# EAGLE design PHT_logger (EAGLE 9.6.2)
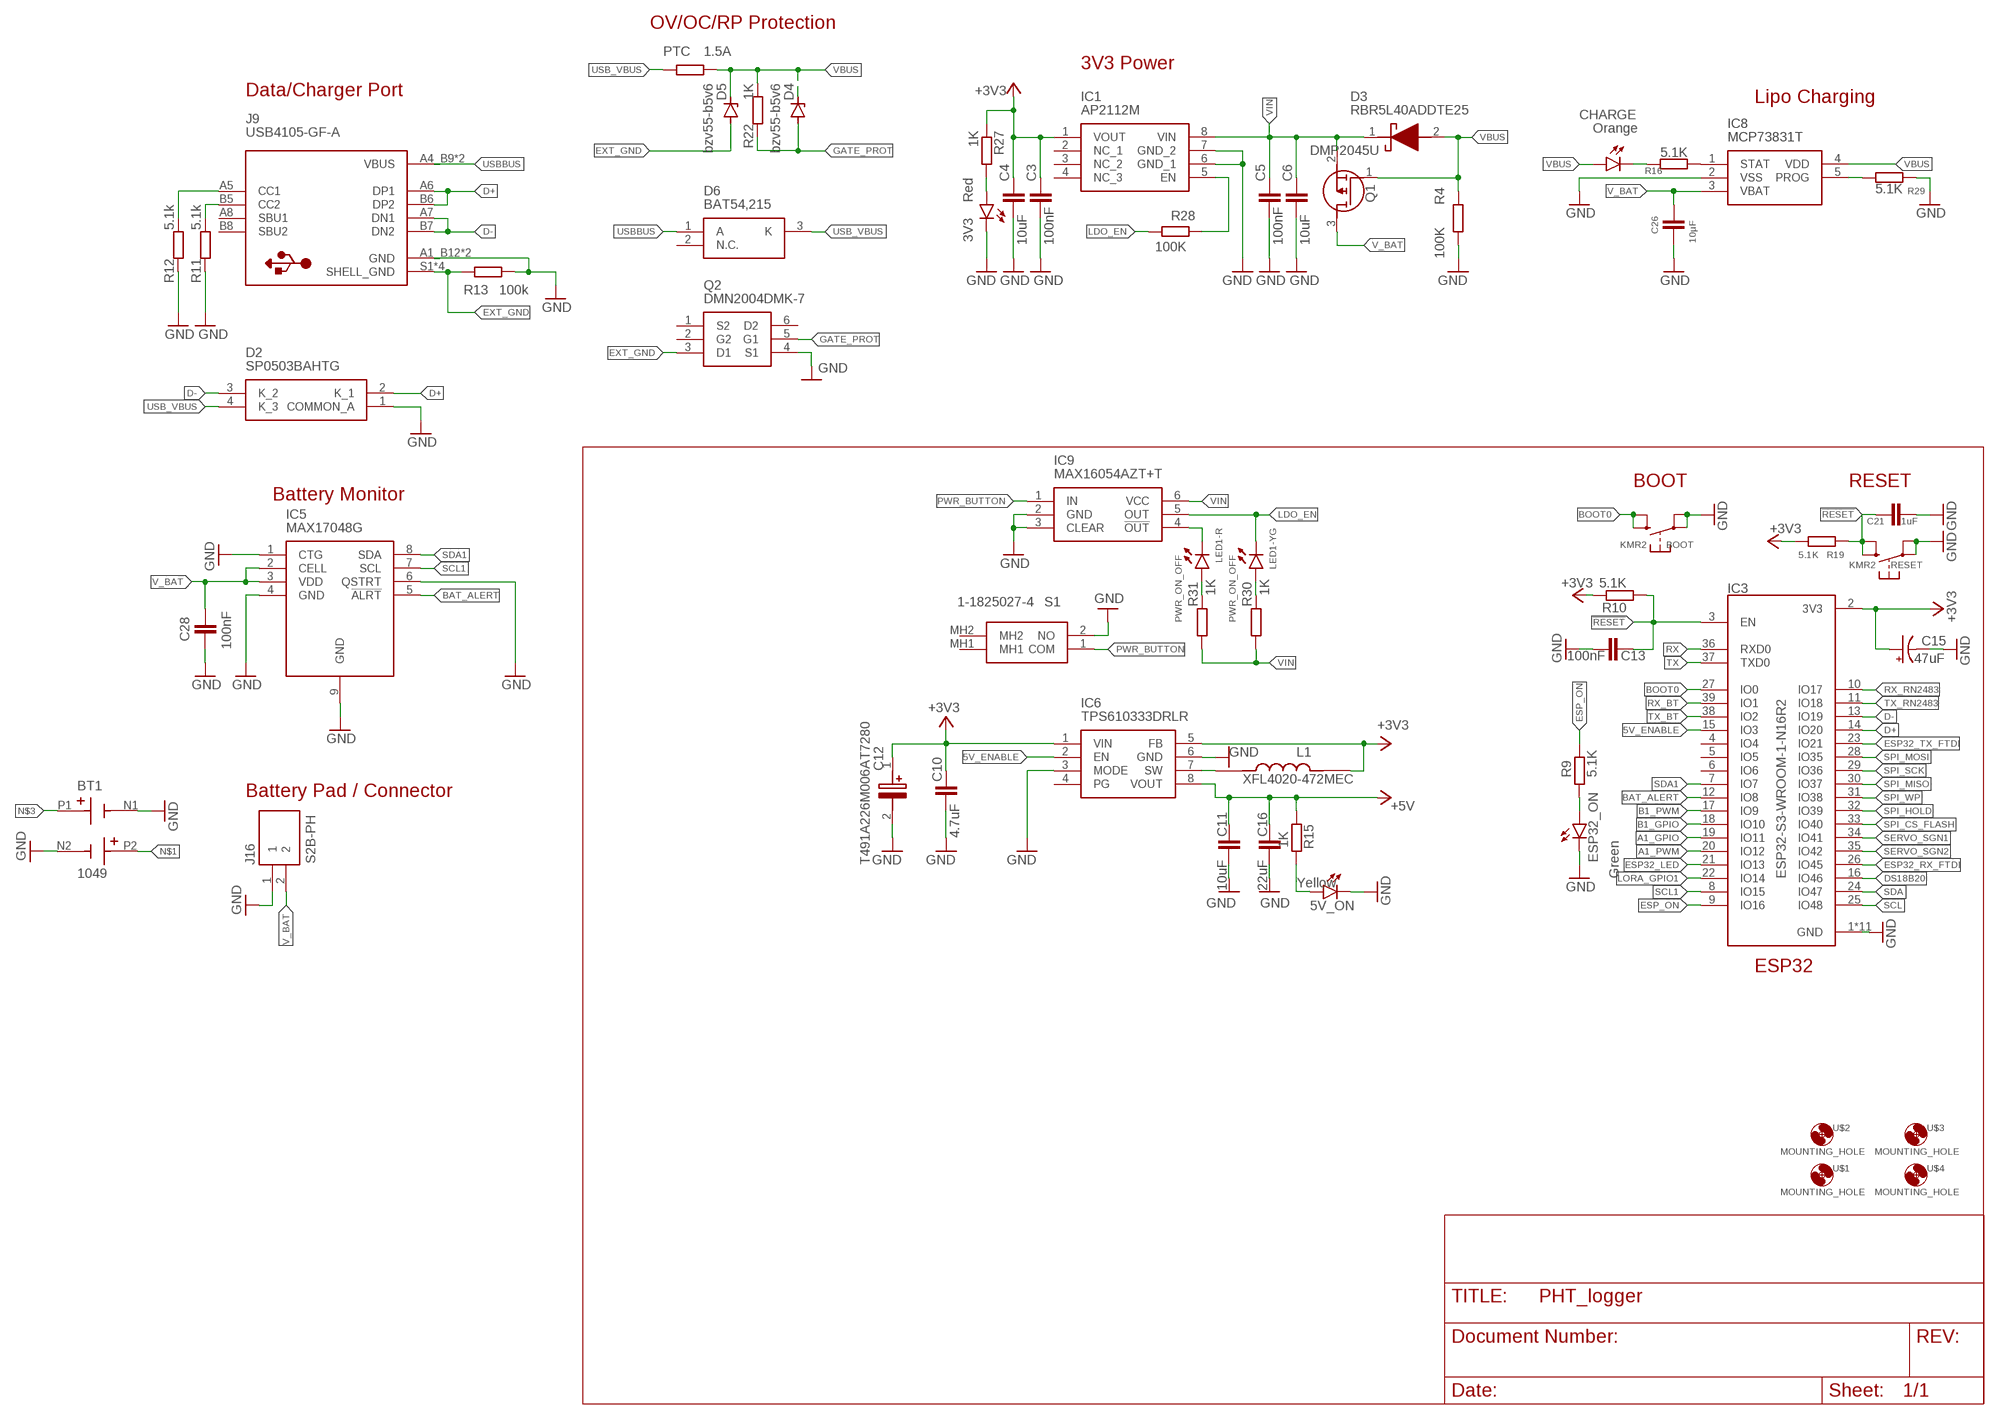
[diagram p0: schematic, sheet 1]

## Parts
3V3  Red  LEDCHIPLED_0805  [CHIPLED_0805]
5V_ON  Yellow  LEDCHIPLED_0805  [CHIPLED_0805]
BOOT  KMR2  SWITCH_TACT_SMT4.6X2.8  [BTN_KMR2_4.6X2.8]
BT1  1049  [BAT_1049]
C3  100nF  C-EUC0603  [C0603]
C4  10uF  C-EUC0603  [C0603]
C5  100nF  C-EUC0603  [C0603]
C6  10uF  C-EUC0603  [C0603]
C10  4.7uF  C-EUC0805  [C0805]
C11  10uF  C-EUC0805  [C0805]
C12  T491A226M006AT7280  [T491A]
C13  100nF  C-EUC0603  [C0603]
C15  47uF  293D226X9025C2TE3  [CAPMP6032X250N]
C16  22uF  C-EUC0805  [C0805]
C21  1uF  C-EUC0603  [C0603]
C26  10µF  C-EUC0603K  [C0603K]
C28  100nF  C-EUC0603  [C0603]
CHARGE  Orange  LEDCHIPLED_0805  [CHIPLED_0805]
D2  SP0503BAHTG  [SP0503BAHTG]
D3  RBR5L40ADDTE25  [DIOM5026X220N]
D4  bzv55-b5v6  ZENER-DIODESOD80C  [SOD80C]
D5  bzv55-b5v6  ZENER-DIODESOD80C  [SOD80C]
D6  BAT54,215  [SOT95P230X110-3N]
ESP32_ON  Green  LEDCHIPLED_0805  [CHIPLED_0805]
IC1  AP2112M  AP2112M-3.3TRG1  [SOIC127P600X170-8N]
IC3  ESP32-S3-WROOM-1-N16R2  [XCVR_ESP32-S3-WROOM-1-N16R2]
IC5  MAX17048G  MAX17048G+T10  [SON50P200X200X80-9N]
IC6  TPS610333DRLR  [SOTFL50P160X60-8N]
IC8  MCP73831T  MCP73831T-2ACI_OT  [SOT95P270X145-5N]
IC9  MAX16054AZT+T  [SOT95P275X110-6N]
J9  USB4105-GF-A  [GCT_USB4105-GF-A]
J16  S2B-PH  S2B-PH-K-S(LF)(SN)  [JST_S2B-PH-K-S(LF)(SN)]
L1  XFL4020-472MEC  [IND_XFL4020-472MEC]
LED1  PWR_ON_OFF  OSRG1206C1C  [3216(1206)-4]
PTC  1.5A  R-EU_R2512  [R2512]
Q1  DMP2045U  DMP2045U-7  [SOT96P240X110-3N]
Q2  DMN2004DMK-7  [SOT95P285X145-6N]
R4  100K  R-EU_R0603  [R0603]
R9  5.1K  R-EU_R0603  [R0603]
R10  5.1K  R-EU_R0603  [R0603]
R11  5.1k  R-EU_R0603  [R0603]
R12  5.1k  R-EU_R0603  [R0603]
R13  100k  R-EU_R0603  [R0603]
R15  1K  R-EU_R0603  [R0603]
R16  5.1K  R-EU_R0603  [R0603]
R19  5.1K  R-EU_R0603  [R0603]
R22  1K  R-EU_R0603  [R0603]
R27  1K  R-EU_R0603  [R0603]
R28  100K  R-EU_R0603  [R0603]
R29  5.1K  R-EU_R0603  [R0603]
R30  1K  R-EU_R0603  [R0603]
R31  1K  R-EU_R0603  [R0603]
RESET  KMR2  SWITCH_TACT_SMT4.6X2.8  [BTN_KMR2_4.6X2.8]
S1  1-1825027-4  [118250274]
U$1  MOUNTING_HOLE  [MOUNTING_HOLE]
U$2  MOUNTING_HOLE  [MOUNTING_HOLE]
U$3  MOUNTING_HOLE  [MOUNTING_HOLE]
U$4  MOUNTING_HOLE  [MOUNTING_HOLE]

## Nets
5V_ENABLE: IC3.15(IO3) IC6.2(EN)
!RESET: C13.1 C21.1 IC3.3(EN) R10.1 R19.1 RESET.B'(S1) RESET.B(S)
+3V3: C3.2 C4.2 C10.2 C12.1(+) C15.1(+) IC1.1(VOUT) IC3.2(3V3) IC6.1(VIN) IC6.5(FB) L1.2 R10.2 R19.2 R27.1
+5V: C11.2 C16.2 IC6.8(VOUT) R15.1
A1_GPIO: IC3.19(IO11)
A1_PWM: IC3.20(IO12)
B1_GPIO: IC3.18(IO10)
B1_PWM: IC3.17(IO9)
BAT_ALERT: IC3.12(IO8) IC5.5(!ALRT)
BOOT0: BOOT.B'(S1) BOOT.B(S) IC3.27(IO0)
D+: D2.2(K_1) IC3.14(IO20) J9.A6(DP1) J9.B6(DP2)
D-: D2.3(K_2) IC3.13(IO19) J9.A7(DN1) J9.B7(DN2)
DS18B20: IC3.16(IO46)
ESP32_LED: IC3.21(IO13)
ESP32_RX_FTDI: IC3.26(IO45)
ESP32_TX_FTDI: IC3.23(IO21)
ESP_ON: IC3.9(IO16) R9.2
EXT_GND: D5.A J9.S1(SHELL_GND) J9.S2(SHELL_GND) J9.S3(SHELL_GND) J9.S4(SHELL_GND) Q2.3(D1) R13.2
GATE_PROT: D4.A Q2.5(G1) R22.1
GND: 3V3.C 5V_ON.C BOOT.A'(P1) BOOT.A(P) BT1.N1(NEG1) BT1.N2(NEG2) C3.1 C4.1 C5.1 C6.1 C10.1 C11.1 C12.2(-) C13.2 C15.2(-) C16.1 C21.2 C26.2 C28.2 D2.1(COMMON_A) ESP32_ON.C IC1.6(GND_1) IC1.7(GND_2) IC3.1(GND) IC3.40(GND) IC3.41_1(GND) IC3.41_2(GND) IC3.41_3(GND) IC3.41_4(GND) IC3.41_5(GND) IC3.41_6(GND) IC3.41_7(GND) IC3.41_8(GND) IC3.41_9(GND) IC5.1(CTG) IC5.4(GND) IC5.6(QSTRT) IC5.9(GND) IC6.3(MODE) IC6.6(GND) IC8.2(VSS) IC9.2(GND) IC9.3(CLEAR) J9.A1_B12(GND) J9.B1_A12(GND) J16.1 Q2.4(S1) R4.2 R11.1 R12.1 R13.1 R29.1 RESET.A'(P1) RESET.A(P) S1.2(NO)
LDO_EN: IC9.5(OUT) LED1.3(-YG:C) R28.1
LORA_GPIO1: IC3.22(IO14)
N$1: BT1.P2(POS2)
N$3: BT1.P1(POS1)
N$6: ESP32_ON.A R9.1
N$9: IC6.7(SW) L1.1
N$10: 5V_ON.A R15.2
N$11: CHARGE.C R16.1
N$12: IC9.4(!OUT) LED1.1(-R:C)
N$13: IC1.5(EN) R28.2
N$14: LED1.4(-YG:A) R30.2
N$15: LED1.2(-R:A) R31.2
N$16: J9.B5(CC2) R11.2
N$17: IC8.1(STAT) R16.2
N$18: IC8.5(PROG) R29.2
N$21: J9.A5(CC1) R12.2
N$33: 3V3.A R27.2
PWR_BUTTON: IC9.1(IN) S1.1(COM)
RX: IC3.36(RXD0)
RX_BT: IC3.39(IO1)
RX_RN2483: IC3.10(IO17)
SCL: IC3.25(IO48)
SCL1: IC3.8(IO15) IC5.7(SCL)
SDA: IC3.24(IO47)
SDA1: IC3.7(IO7) IC5.8(SDA)
SERVO_SGN1: IC3.34(IO41)
SERVO_SGN2: IC3.35(IO42)
SPI_CS_FLASH: IC3.33(IO40)
SPI_HOLD: IC3.32(IO39)
SPI_MISO: IC3.30(IO37)
SPI_MOSI: IC3.28(IO35)
SPI_SCK: IC3.29(IO36)
SPI_WP: IC3.31(IO38)
TX: IC3.37(TXD0)
TX_BT: IC3.38(IO2)
TX_RN2483: IC3.11(IO18)
USB_VBUS: D2.4(K_3) D6.3(K) PTC.1
USBBUS: D6.1(A) J9.A4_B9(VBUS) J9.B4_A9(VBUS)
V_BAT: C26.1 C28.1 IC5.2(CELL) IC5.3(VDD) IC8.3(VBAT) J16.2 Q1.3(D)
VBUS: CHARGE.A D3.2(A) D4.C D5.C IC8.4(VDD) PTC.2 Q1.1(G) R4.1 R22.2
VIN: C5.2 C6.2 D3.1(K) IC1.8(VIN) IC9.6(VCC) Q1.2(S) R30.1 R31.1
Unconnected: D6.2(N.C.) IC1.2(NC_1) IC1.3(NC_2) IC1.4(NC_3) IC3.4(IO4) IC3.5(IO5) IC3.6(IO6) IC6.4(PG) J9.A8(SBU1) J9.B8(SBU2) Q2.1(S2) Q2.2(G2) Q2.6(D2) S1.MH1 S1.MH2

## Notes on the sheet
- OV/OC/RP Protection
- 3V3 Power
- Data/Charger Port
- Lipo Charging
- BOOT | RESET
- Battery Monitor
- Battery Pad / Connector
- ESP32

## Library data of the parts
3V3 5V_ON CHARGE ESP32_ON = led:LED: LED OSRAM: - CHIPLED LG R971, LG N971, LY N971, LG Q971, LY Q971, LO R971, LY R971 LH N974, LH R974 LS Q976, LO Q976, LY Q976 LO Q996 - Hyper CHIPLED LW Q18S LB Q993, LB Q99A, LB R99A - SideLED LS A670, LO A670, LY A670, LG A670, LP A670 LB A673, LV A673, LT A673, LW A673 LH A674 LY A675 LS A676, LA A676, LO A676, LY A676, LW A676 LS A679, LY A679, LG A679 - Hyper Micro SIDELED® LS Y876, LA Y876, LO Y876, LY Y876 LT Y87S - SmartLED LW L88C, LW L88S LB L89C, LB L89S, LG L890 LS L89K, LO L89K, LY L89K LS L896, LA L896, LO L896, LY L896 - TOPLED LS T670, LO T670, LY T670, LG T670, LP T670 LSG T670, LSP T670, LSY T670, LOP T670, LYG T670 LG T671, LOG T671, LSG T671 LB T673, LV T673, LT T673, LW T673 LH T674 LS T676, LA T676, LO T676, LY T676, LB T676, LH T676, LSB T676, LW T676 LB T67C, LV T67C, LT T67C, LS T67K, LO T67K, LY T67K, LW E67C LS E67B, LA E67B, LO E67B, LY E67B, LB E67C, LV E67C, LT E67C LW T67C LS T679, LY T679, LG T679 LS T770, LO T770, LY T770, LG T770, LP T770 LB T773, LV T773, LT T773, LW T773 LH T774 LS E675, LA E675, LY E675, LS T675 LS T776, LA T776, LO T776, LY T776, LB T776 LHGB T686 LT T68C, LB T68C - Hyper Mini TOPLED® LB M676 - Mini TOPLED Santana® LG M470 LS M47K, LO M47K, LY M47K Source: http://www.osram.convergy.de LUXEON: - LUMILED® LXK2-PW12-R00, LXK2-PW12-S00, LXK2-PW14-U00, LXK2-PW14-V00 LXK2-PM12-R00, LXK2-PM12-S00, LXK2-PM14-U00 LXK2-PE12-Q00, LXK2-PE12-R00, LXK2-PE12-S00, LXK2-PE14-T00, LXK2-PE14-U00 LXK2-PB12-K00, LXK2-PB12-L00, LXK2-PB12-M00, LXK2-PB14-N00, LXK2-PB14-P00, LXK2-PB14-Q00 LXK2-PR12-L00, LXK2-PR12-M00, LXK2-PR14-Q00, LXK2-PR14-R00 LXK2-PD12-Q00, LXK2-PD12-R00, LXK2-PD12-S00 LXK2-PH12-R00, LXK2-PH12-S00 LXK2-PL12-P00, LXK2-PL12-Q00, LXK2-PL12-R00 Source: www.luxeon.com KINGBRIGHT: KA-3528ASYC Source: www.kingbright.com
BOOT RESET = microbuilder:SWITCH_TACT_SMT: SMT Tact Switches 6x6mm - Digikey: P12940SCT-ND KMR2 (4.6x2.8mm) - Digikey: 401-1426-1-ND EVQ-PQHB55 - Light Touch, 160GF (4.5x4.5mm) - Digikey: P8090SCT-ND KMT0 - KMT021 NGJ LHS (etc.) IP68/Waterproof - Digikey: CKN10289CT-ND
BT1 = 1049:1049: Check availability <https://pricing.snapeda.com/parts/1049/Keystone%20Electronics/view-part?ref=eda>; AVAILABILITY: In Stock; CHECK_PRICES: https://www.snapeda.com/parts/1049/Keystone/view-part/?ref=eda; DESCRIPTION: THM Holder for Dual 18650 Batteries; MF: Keystone Electronics; MP: 1049; PACKAGE: None; PRICE: None; PURCHASE-URL: https://www.snapeda.com/api/url_track_click_mouser/?unipart_id=5529224&manufacturer=Keystone Electronics&part_name=1049&search_term=None; SNAPEDA_LINK: https://www.snapeda.com/parts/1049/Keystone/view-part/?ref=snap
C3-C6 C10 C11 C13 C16 C21 C26 C28 = rcl:C-EU: CAPACITOR, European symbol; SPICEPREFIX: C
C12 = T491A226M006AT7280:T491A226M006AT7280: T491, Tantalum, MnO2 Tantalum, Commercial Grade, 22 uF, 20%, 6.3 VDC, 125C, -55C, 85C, SMD, MnO2, Molded, 6 % , 3 Ohms, 1400 nA, 58.6 mg, 3216, 1.6mm, Height Max = 1.8mm, 9000, 156 Weeks Source: Datasheet <https://content.kemet.com/datasheets/KEM_T2005_T491.pdf>; DESCRIPTION: T491, Tantalum, MnO2 Tantalum, Commercial Grade, 22 uF, 20%, 6.3 VDC, 125C, -55C, 85C, SMD, MnO2, Molded, 6 % , 3 Ohms, 1400 nA, 58.6 mg, 3216, 1.6mm, Height Max = 1.8mm, 9000, 156 Weeks; HEIGHT: 1.8mm; MANUFACTURER_NAME: KEMET; MANUFACTURER_PART_NUMBER: T491A226M006AT7280
C15 = 293D226X9025C2TE3:293D226X9025C2TE3: Surface Mount Tantalum Capacitor, TANTAMOUNTr, 293D Series, 22 F, 10%, 25 V, 2412 Check prices <https://pricing.snapeda.com/parts/293D226X9025C2TE3/Vishay/view-part?ref=eda>; AVAILABILITY: Warning; DESCRIPTION: Surface Mount Tantalum Capacitor, TANTAMOUNTr, 293D Series, 22 F, 10%, 25 V, 2412 [6032 Metric]; MF: Vishay; MP: 293D226X9025C2TE3; PACKAGE: None; PRICE: None; PURCHASE-URL: https://pricing.snapeda.com/search/part/293D226X9025C2TE3/?ref=eda
D2 = SP0503BAHTG:SP0503BAHTG: ESD Suppressors / TVS Diodes TVS AVAL DIODE SMT Source: Datasheet; DESCRIPTION: ESD Suppressors / TVS Diodes TVS AVAL DIODE SMT; HEIGHT: 1.22mm; MANUFACTURER_NAME: LITTELFUSE; MANUFACTURER_PART_NUMBER: SP0503BAHTG; MOUSER_PART_NUMBER: 576-SP0503BAHTG; MOUSER_PRICE-STOCK: https://www.mouser.co.uk/ProductDetail/Littelfuse/SP0503BAHTG?qs=uD%2FdkN7XIa0NTYXwHdELYA%3D%3D
D3 = RBR5L40ADDTE25:RBR5L40ADDTE25: Low VF, 40V, 5A, DO-214AC (SMA), Schottky Barrier Diode for Automotive Source: Datasheet <https://fscdn.rohm.com/en/products/databook/datasheet/discrete/diode/schottky_barrier/rbr5l40addte25-e.pdf>; DESCRIPTION: Low V<sub>F</sub>, 40V, 5A, DO-214AC (SMA), Schottky Barrier Diode for Automotive; HEIGHT: 2.2mm; MANUFACTURER_NAME: ROHM Semiconductor; MANUFACTURER_PART_NUMBER: RBR5L40ADDTE25; MOUSER_PART_NUMBER: 755-RBR5L40ADDTE25; MOUSER_PRICE-STOCK: https://www.mouser.co.uk/ProductDetail/ROHM-Semiconductor/RBR5L40ADDTE25?qs=4v%252BiZTmLVHF3vONcYZtHDg%3D%3D
D4 D5 = diode:ZENER-DIODE: Z-Diode
D6 = BAT54_215:BAT54,215: Schottky barrier diode,BAT54 0.2A 30V NXP BAT54,215, SMT Schottky Diode, 30V 200mA, 5ns, 3-Pin TO-236AB Source: Datasheet <https://assets.nexperia.com/documents/data-sheet/BAT54.pdf>; DESCRIPTION: Schottky barrier diode,BAT54 0.2A 30V NXP BAT54,215, SMT Schottky Diode, 30V 200mA, 5ns, 3-Pin TO-236AB; HEIGHT: 1.1mm; MANUFACTURER_NAME: Nexperia; MANUFACTURER_PART_NUMBER: BAT54,215; MOUSER_PART_NUMBER: 771-BAT54-T/R; MOUSER_PRICE-STOCK: https://www.mouser.co.uk/ProductDetail/Nexperia/BAT54215?qs=me8TqzrmIYXKuR53XX9Zmg%3D%3D
IC1 = AP2112M-3.3TRG1:AP2112M-3.3TRG1: LDO Voltage Regulators LDO CMOS HiCurr Source: Datasheet <https://www.diodes.com/assets/Datasheets/AP2112.pdf>; DESCRIPTION: LDO Voltage Regulators LDO CMOS HiCurr; HEIGHT: 1.7mm; MANUFACTURER_NAME: Diodes Inc.; MANUFACTURER_PART_NUMBER: AP2112M-3.3TRG1; MOUSER_PART_NUMBER: 621-AP2112M-3.3TRG1; MOUSER_PRICE-STOCK: https://www.mouser.co.uk/ProductDetail/Diodes-Incorporated/AP2112M-3.3TRG1?qs=5V6w%252Be2aIqa1YM8VADFBsQ%3D%3D
IC3 = ESP32-S3-WROOM-1-N16R2_v2a:ESP32-S3-WROOM-1-N16R2: Check availability <https://pricing.snapeda.com/parts/ESP32-S3-WROOM-1-N16R2/Espressif%20Systems/view-part?ref=eda>; AVAILABILITY: In Stock; DESCRIPTION: Bluetooth, WiFi 802.11b/g/n, Bluetooth v5.0 Transceiver Module 2.4GHz PCB Trace Surface Mount; MF: Espressif Systems; MP: ESP32-S3-WROOM-1-N16R2; PACKAGE: None; PRICE: None; PURCHASE-URL: https://pricing.snapeda.com/search?q=ESP32-S3-WROOM-1-N16R2&ref=eda; SPICEPREFIX: X
IC5 = MAX17048G+T10:MAX17048G+T10: Battery Management Host-Side Modelgauge (1-Cell) Source: Datasheet <https://datasheets.maximintegrated.com/en/ds/MAX17048-MAX17049.pdf>; DESCRIPTION: Battery Management Host-Side Modelgauge (1-Cell); HEIGHT: 0.8mm; MANUFACTURER_NAME: Maxim Integrated; MANUFACTURER_PART_NUMBER: MAX17048G+T10; MOUSER_PART_NUMBER: 700-MAX17048G+T10; MOUSER_PRICE-STOCK: https://www.mouser.co.uk/ProductDetail/Maxim-Integrated/MAX17048G%2bT10?qs=D7PJwyCwLAoGnnn8jEPRBQ%3D%3D
IC6 = TPS610333DRLR:TPS610333DRLR: Switching Voltage Regulators 5-V, 1.85-A boost converter with power good, output discharge and PFM/PWM control 8-SOT-5X3 -40 to 125 Source: Datasheet <https://www.ti.com/lit/ds/symlink/tps610333.pdf?HQS=dis-mous-null-mousermode-dsf-pf-null-wwe&ts=1702892609293&ref_url=https%3A%2F%2Fwww.mouser.es%2F>; DESCRIPTION: Switching Voltage Regulators 5-V, 1.85-A boost converter with power good, output discharge and PFM/PWM control 8-SOT-5X3 -40 to 125; HEIGHT: 0.6mm; MANUFACTURER_NAME: Texas Instruments; MANUFACTURER_PART_NUMBER: TPS610333DRLR; MOUSER_PART_NUMBER: 595-TPS610333DRLR; MOUSER_PRICE-STOCK: https://www.mouser.co.uk/ProductDetail/Texas-Instruments/TPS610333DRLR?qs=HoCaDK9Nz5dzV%252Bptf%2FLKkg%3D%3D
IC8 = MCP73831T-2ACI_OT:MCP73831T-2ACI_OT: Li-Ion Charge Controller 4.2V SOT23-5 Source: Datasheet <http://ww1.microchip.com/downloads/en/DeviceDoc/20001984g.pdf>; DESCRIPTION: Li-Ion Charge Controller 4.2V SOT23-5; HEIGHT: 1.45mm; MANUFACTURER_NAME: Microchip; MANUFACTURER_PART_NUMBER: MCP73831T-2ACI/OT; MOUSER_PART_NUMBER: 579-MCP73831T-2ACIOT; MOUSER_PRICE-STOCK: https://www.mouser.co.uk/ProductDetail/Microchip-Technology/MCP73831T-2ACI-OT?qs=yUQqVecv4qvbBQBGbHx0Mw%3D%3D
IC9 = MAX16054AZT+T:MAX16054AZT+T: On Off Controller, Debounce, 15kV ESD MAX16054AZT+T, Voltage Supervisor No Push Button Controller 6-Pin SOT-23 Source: Datasheet <https://datasheet.datasheetarchive.com/originals/distributors/SFDatasheet-4/sf-00087822.pdf>; DESCRIPTION: On Off Controller, Debounce, 15kV ESD MAX16054AZT+T, Voltage Supervisor No Push Button Controller 6-Pin SOT-23; HEIGHT: 1.1mm; MANUFACTURER_NAME: Analog Devices; MANUFACTURER_PART_NUMBER: MAX16054AZT+T; MOUSER_PART_NUMBER: 700-MAX16054AZTT; MOUSER_PRICE-STOCK: https://www.mouser.co.uk/ProductDetail/Analog-Devices-Maxim-Integrated/MAX16054AZT%2bT?qs=CDqwynd4ZNoG75aAAjGoqQ%3D%3D
J9 = USB4105-GF-A:USB4105-GF-A: USB-C (USB TYPE-C) USB 2.0 Receptacle Connector 24 (16+8 Dummy) Position Surface Mount, Right Angle; Through Hole Check availability <https://pricing.snapeda.com/parts/USB4105-GF-A/GCT/view-part?ref=eda>; AVAILABILITY: In Stock; DESCRIPTION: USB-C (USB TYPE-C) USB 2.0 Receptacle Connector 24 (16+8 Dummy) Position Surface Mount, Right Angle; Through Hole; MF: GCT; MP: USB4105-GF-A; PACKAGE: None; PRICE: None; PURCHASE-URL: https://pricing.snapeda.com/search/part/USB4105-GF-A/?ref=eda
J16 = S2B-PH-K-S_LF__SN_:S2B-PH-K-S(LF)(SN): PH Series 2 Position 2.0 mm Through Hole Side Entry Shrouded Header Check availability <https://pricing.snapeda.com/parts/S2B-PH-K-S%28LF%29%28SN%29/JST%20Sales%20America%20Inc./view-part?ref=eda>; AVAILABILITY: In Stock; DESCRIPTION: Connector Header Through Hole, Right Angle 2 position 0.079 (2.00mm); MF: JST Sales America Inc.; MP: S2B-PH-K-S(LF)(SN); PACKAGE: None; PRICE: None; PURCHASE-URL: https://pricing.snapeda.com/search/part/S2B-PH-K-S(LF)(SN)/?ref=eda
L1 = XFL4020-472MEC:XFL4020-472MEC: Check availability <https://pricing.snapeda.com/parts/XFL4020-472MEC/Coilcraft/view-part?ref=eda>; AVAILABILITY: In Stock; CHECK_PRICES: https://www.snapeda.com/parts/XFL4020-472MEC/Coilcraft/view-part/?ref=eda; DESCRIPTION: 4.7 µH Shielded Molded Inductor 5 A 57.4mOhm Max 1616 (4040 Metric); MF: Coilcraft; MP: XFL4020-472MEC; PACKAGE: None; PRICE: None; SNAPEDA_LINK: https://www.snapeda.com/parts/XFL4020-472MEC/Coilcraft/view-part/?ref=snap
LED1 = OSRG1206C1C:OSRG1206C1C: Bi-color LED Check availability <https://pricing.snapeda.com/parts/OSRG1206C1C/OptoSupply/view-part?ref=eda>; AVAILABILITY: Not in stock; CHECK_PRICES: https://www.snapeda.com/parts/OSRG1206C1C/OptoSupply/view-part/?ref=eda; DESCRIPTION: LED; SMD; 1206; red/green; 3.2x2.7mm; 120°; Variant: bicolour; MF: OptoSupply; MP: OSRG1206C1C; PACKAGE: None; PRICE: None; SNAPEDA_LINK: https://www.snapeda.com/parts/OSRG1206C1C/OptoSupply/view-part/?ref=snap
PTC R4 R9-R13 R15 R16 R19 R22 R27-R31 = rcl:R-EU_: RESISTOR, European symbol; SPICEPREFIX: R
Q1 = DMP2045U-7:DMP2045U-7: DMP2045U-7 P-Channel MOSFET, 3.5 (State) A, 4.3 (Steady) A, 20 V, 3-Pin SOT-23 Diodes Inc Source: Datasheet <https://www.diodes.com/assets/Datasheets/DMP2045U.pdf>; DESCRIPTION: DMP2045U-7 P-Channel MOSFET, 3.5 (State) A, 4.3 (Steady) A, 20 V, 3-Pin SOT-23 Diodes Inc; HEIGHT: 1.1mm; MANUFACTURER_NAME: Diodes Inc.; MANUFACTURER_PART_NUMBER: DMP2045U-7; MOUSER_PART_NUMBER: 621-DMP2045U-7; MOUSER_PRICE-STOCK: https://www.mouser.co.uk/ProductDetail/Diodes-Incorporated/DMP2045U-7?qs=rrS6PyfT74erdUwo5CgHTg%3D%3D
Q2 = DMN2004DMK-7:DMN2004DMK-7: Diodes Inc DMN2004DMK-7 Dual N-channel MOSFET Transistor, 0.54 A, 20 V, 6-Pin SOT-26 Source: Datasheet <https://componentsearchengine.com/Datasheets/1/DMN2004DMK-7.pdf>; DESCRIPTION: Diodes Inc DMN2004DMK-7 Dual N-channel MOSFET Transistor, 0.54 A, 20 V, 6-Pin SOT-26; HEIGHT: 1.45mm; MANUFACTURER_NAME: Diodes Inc.; MANUFACTURER_PART_NUMBER: DMN2004DMK-7; MOUSER_PART_NUMBER: 621-DMN2004DMK-7; MOUSER_PRICE-STOCK: https://www.mouser.co.uk/ProductDetail/Diodes-Incorporated/DMN2004DMK-7?qs=mQbszxtPdlMH8tFhUIsOEA%3D%3D
S1 = 1-1825027-4:1-1825027-4: Switch Tactile OFF (ON) SPST Round Button PC Pins 0.05A 24VDC 1.57N Thru-Hole Loose Source: Datasheet <https://componentsearchengine.com/Datasheets/1/1-1825027-4.pdf>; DESCRIPTION: Switch Tactile OFF (ON) SPST Round Button PC Pins 0.05A 24VDC 1.57N Thru-Hole Loose; HEIGHT: 7.01mm; MANUFACTURER_NAME: TE Connectivity; MANUFACTURER_PART_NUMBER: 1-1825027-4
U$1-U$4 = Padded_mounting holes:MOUNTING_HOLE

## Board
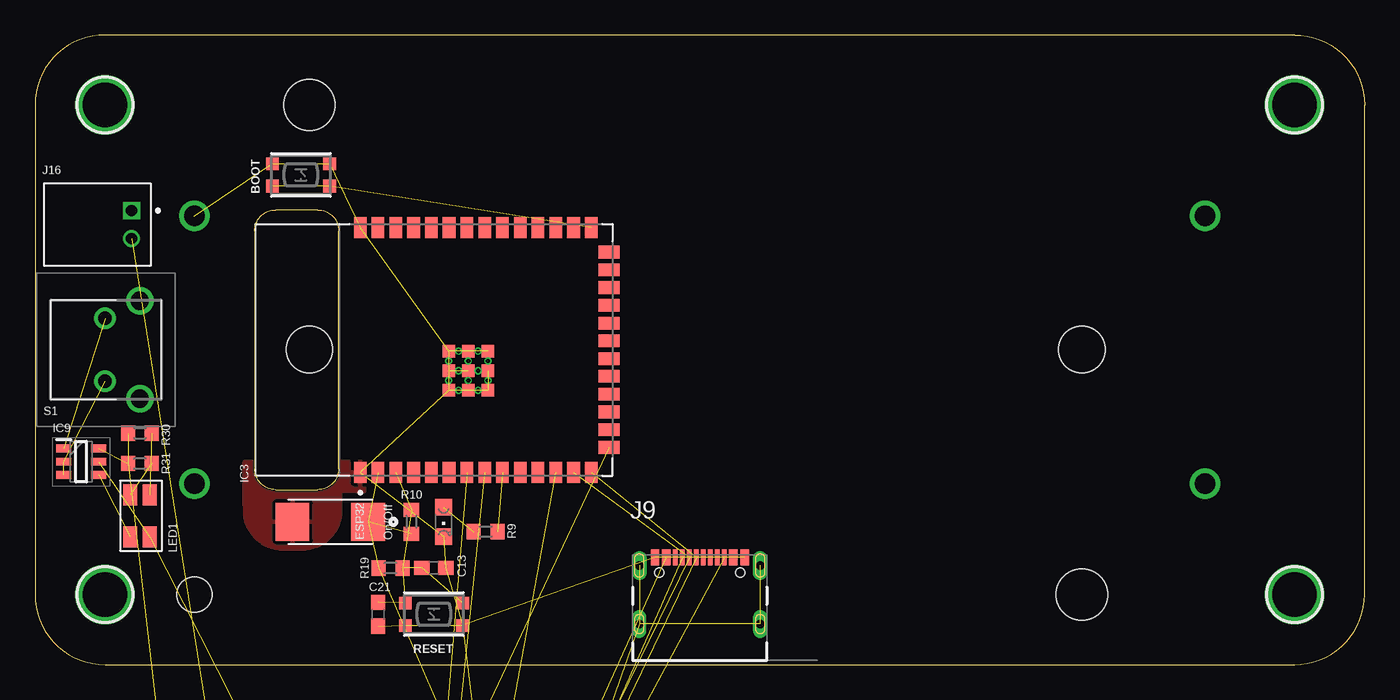
[diagram p1: board, top side]
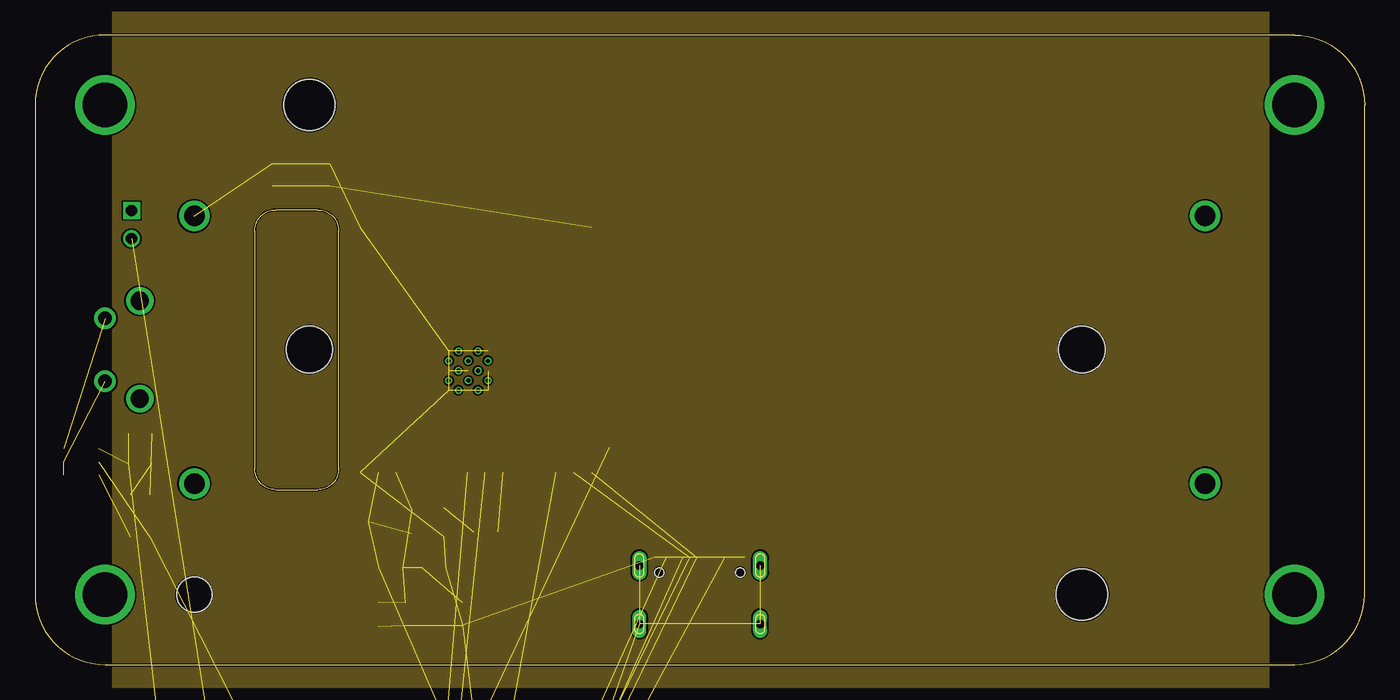
[diagram p2: board, inner layer Route2]
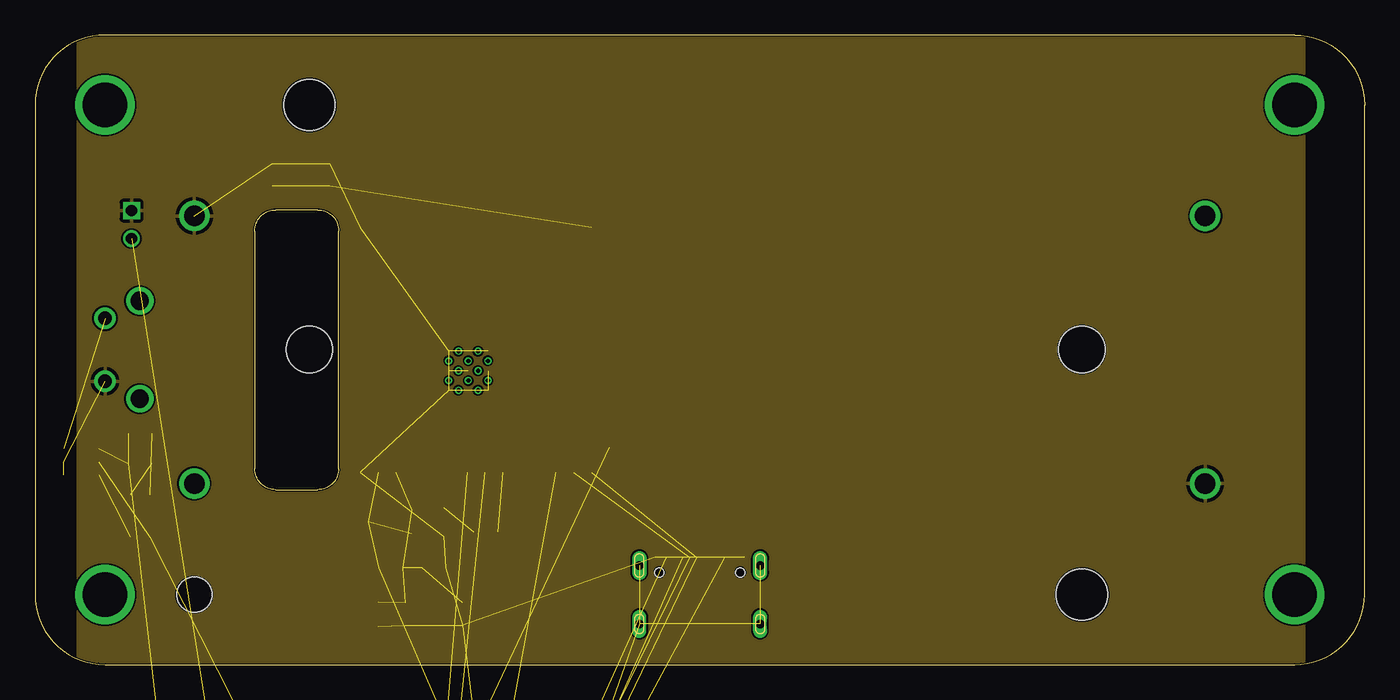
[diagram p3: board, inner layer Route15]
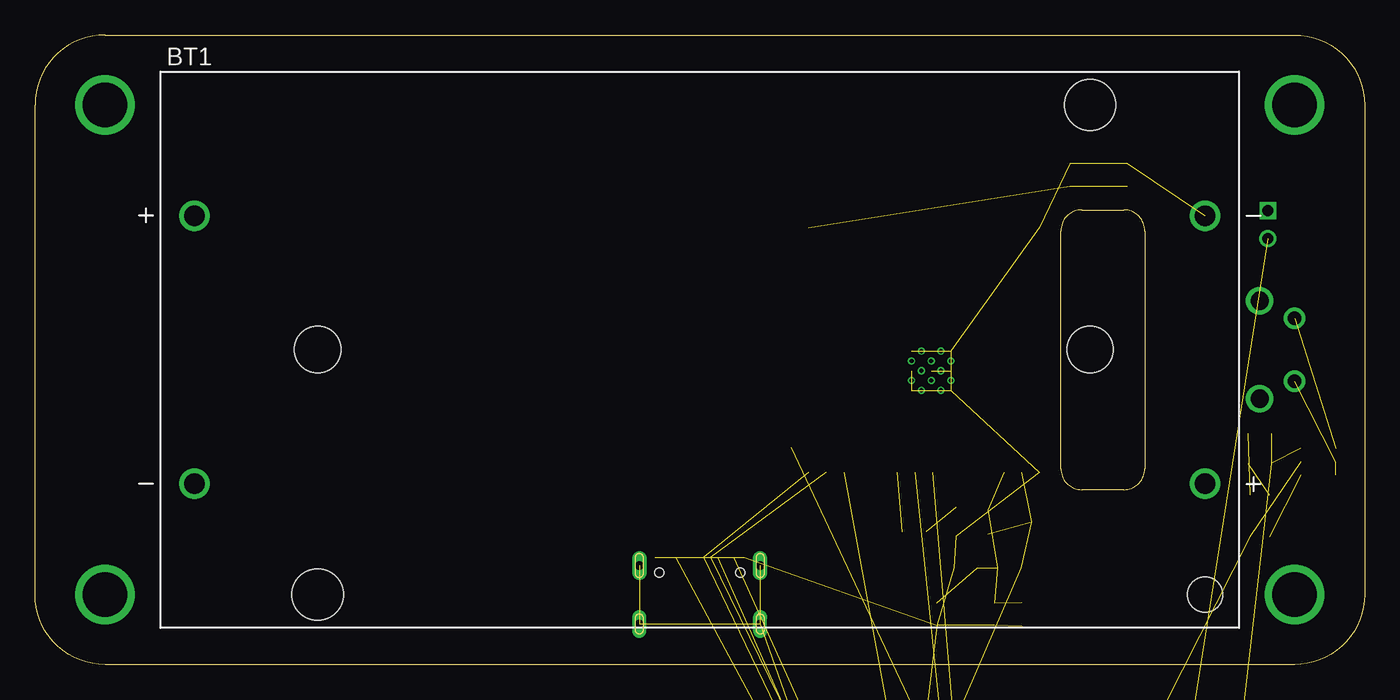
[diagram p4: board, bottom side, seen from below]

Size 95 x 45 mm. Coordinates in mm from the lower left corner, seen from the top.
Outline: 5,0 90,0 arc90 95,5 95,40 arc90 90,45 5,45 arc90 0,40 0,5 arc90 5,0
Outline: 17.2,12.5 20.2,12.5 arc90 21.7,14 21.7,31 arc90 20.2,32.5 17.2,32.5 arc90 15.7,31 15.7,14 arc90 17.2,12.5
Copper layers (1*2*15*16): Top 0.035559375mm / dielectric 0.17018125mm / Route2 0.01778125mm / dielectric 47mil / Route15 0.01778125mm / dielectric 0.17018125mm / Bottom 0.035559375mm
Design rules "jlcpcb-4-layer": minimum track width 5mil, minimum drill 0.2mm, track to track 0.126490625mm, track to pad 0.126490625mm, pad to pad 0.126490625mm, via to via 0.126490625mm, smd to smd 0mil, copper to edge 0.1mm, drill to drill 5mil, minimum pad ring 4mil, minimum via ring 4mil, stop-mask expansion 3mil, vias tented up to drill 100mil, thermal gap 10mil

### Footprints (pad centres in the part's own frame; a part is rotated, then mirrored left to right if it is on the bottom)
CHIPLED_0805 = smd 1.2 x 1.2: A 0,-1.05; C 0,1.05
BTN_KMR2_4.6X2.8 = smd 0.9 x 0.9: A 2.05,0.8; A' -2.05,0.8; B 2.05,-0.8; B' -2.05,-0.8
BAT_1049 = drill 1.45: N1 36.11,9.565; N2 -36.11,-9.565; P1 -36.11,9.565; P2 36.11,-9.565 | hole 3.68: 27.89,17.5; -27.31,-17.5 | hole 2.51: 36.11,-17.5 | hole 3.31: -27.31,0.015; 27.89,0.015
C0603 = smd 1.1 x 1: 1 -0.85,0; 2 0.85,0
C0805 = smd 1.3 x 1.5: 1 -0.95,0; 2 0.95,0
T491A = smd 1.8 x 1.23: 1 -1.31,0; 2 1.31,0
CAPMP6032X250N = smd 2.4 x 2.7: 1 -2.7,0; 2 2.7,0
C0603K = smd 1.05 x 1.08: 1 -0.875,0; 2 0.875,0
SP0503BAHTG = smd 1.1 x 1.4: 1 -0.75,-1.1 | smd 0.9 x 1.4: 2 0.95,-1.1; 3 0.95,1.1; 4 -0.95,1.1
DIOM5026X220N = smd 2.25 x 1.6: 1 -2,0; 2 2,0
SOD80C = smd 1.4 x 1.8: A 1.7,0; C -1.7,0
SOT95P230X110-3N = smd 1.05 x 0.6: 1 -1.1,0.95; 2 -1.1,-0.95; 3 1.1,0
SOIC127P600X170-8N = smd 1.5 x 0.65: 1 -2.7,1.905; 2 -2.7,0.635; 3 -2.7,-0.635; 4 -2.7,-1.905; 5 2.7,-1.905; 6 2.7,-0.635; 7 2.7,0.635; 8 2.7,1.905
XCVR_ESP32-S3-WROOM-1-N16R2 = smd 1.5 x 0.9: 1 -8.75,5.26; 2 -8.75,3.99; 3 -8.75,2.72; 4 -8.75,1.45; 5 -8.75,0.18; 6 -8.75,-1.09; 7 -8.75,-2.36; 8 -8.75,-3.63; 9 -8.75,-4.9; 10 -8.75,-6.17; 11 -8.75,-7.44; 12 -8.75,-8.71; 13 -8.75,-9.98; 14 -8.75,-11.25; 27 8.75,-11.25; 28 8.75,-9.98; 29 8.75,-8.71; 30 8.75,-7.44; 31 8.75,-6.17; 32 8.75,-4.9; 33 8.75,-3.63; 34 8.75,-2.36; 35 8.75,-1.09; 36 8.75,0.18; 37 8.75,1.45; 38 8.75,2.72; 39 8.75,3.99; 40 8.75,5.26 | smd 0.9 x 1.5: 15 -6.985,-12.5; 16 -5.715,-12.5; 17 -4.445,-12.5; 18 -3.175,-12.5; 19 -1.905,-12.5; 20 -0.635,-12.5; 21 0.635,-12.5; 22 1.905,-12.5; 23 3.175,-12.5; 24 4.445,-12.5; 25 5.715,-12.5; 26 6.985,-12.5 | smd 0.9 x 0.9: 41_1 -1.5,-2.46; 41_2 -2.9,-2.46; 41_3 -0.1,-2.46; 41_4 -2.9,-3.86; 41_5 -1.5,-3.86; 41_6 -0.1,-3.86; 41_7 -2.9,-1.06; 41_8 -1.5,-1.06; 41_9 -0.1,-1.06 | drill 0.3 pad 0.45: 41_10 -1.5,-1.76; 41_11 -2.9,-1.76; 41_12 -0.1,-1.76; 41_13 -2.9,-3.16; 41_14 -1.5,-3.16; 41_15 -0.1,-3.16; 41_16 -2.2,-1.06; 41_17 -0.8,-1.06; 41_18 -2.2,-2.46; 41_19 -0.8,-2.46; 41_20 -2.2,-3.86; 41_21 -0.8,-3.86
SON50P200X200X80-9N = smd 0.75 x 0.3: 1 -1,0.75; 2 -1,0.25; 3 -1,-0.25; 4 -1,-0.75; 5 1,-0.75; 6 1,-0.25; 7 1,0.25; 8 1,0.75 | smd 0.9 x 1.3: 9 0,0
SOTFL50P160X60-8N = smd 0.475 x 0.3: 1 -0.838,0.75; 2 -0.838,0.25; 3 -0.838,-0.25; 4 -0.838,-0.75; 5 0.838,-0.75; 6 0.838,-0.25; 7 0.838,0.25; 8 0.838,0.75
SOT95P270X145-5N = smd 1.4 x 0.6: 1 -1.25,0.95; 2 -1.25,0; 3 -1.25,-0.95; 4 1.25,-0.95; 5 1.25,0.95
SOT95P275X110-6N = smd 1.05 x 0.55: 1 -1.25,0.95; 2 -1.25,0; 3 -1.25,-0.95; 4 1.25,-0.95; 5 1.25,0; 6 1.25,0.95
GCT_USB4105-GF-A = smd 0.6 x 1.15: A1_B12 -3.2,4.755; A4_B9 -2.4,4.755; B1_A12 3.2,4.755; B4_A9 2.4,4.755 | smd 0.3 x 1.15: A5 -1.25,4.755; A6 -0.25,4.755; A7 0.25,4.755; A8 1.25,4.755; B5 1.75,4.755; B6 0.75,4.755; B7 -0.75,4.755; B8 -1.75,4.755 | drill 0.6 pad 1.05 long: S1 -4.32,4.18; S4 4.32,4.18 | drill 0.6 pad 1 long: S2 -4.32,0; S3 4.32,0 | hole 0.65: 2.89,3.68; -2.89,3.68
JST_S2B-PH-K-S(LF)(SN) = drill 0.8 square: 1 -1,0 | drill 0.8: 2 1,0
IND_XFL4020-472MEC = smd 0.98 x 3.4: 1 -1.185,0; 2 1.185,0
3216(1206)-4 = smd 1.5 x 1: 1 -1.5,0.775; 2 1.5,0.775; 3 -1.5,-0.625; 4 1.5,-0.625
R2512 = smd 1.8 x 3.2: 1 -2.8,0; 2 2.8,0
SOT96P240X110-3N = smd 1.1 x 0.65: 1 -1.05,0.96; 2 -1.05,-0.96; 3 1.05,0
SOT95P285X145-6N = smd 1.2 x 0.6: 1 -1.3,0.95; 2 -1.3,0; 3 -1.3,-0.95; 4 1.3,-0.95; 5 1.3,0; 6 1.3,0.95
R0603 = smd 1 x 1.1: 1 -0.85,0; 2 0.85,0
118250274 = drill 0.99 pad 1.54: 1 0,0; 2 4.5,0 | drill 1.3 pad 1.95: MH1 -1.255,2.49; MH2 5.755,2.49
MOUNTING_HOLE = drill 3.2: P$1 0,0

### Placement (x,y rotation side)
3V3  6.1,-41 0 top  (outside the outline)
5V_ON  28.83,-18.27 0 top  (outside the outline)
BOOT  19,35 0 top
BT1  47.5,22.5 0 bottom
C3  4.57,-31.35 0 top  (outside the outline)
C4  35.18,-31.35 0 top  (outside the outline)
C5  11.05,-31.35 0 top  (outside the outline)
C6  4.57,-36.3 0 top  (outside the outline)
C10  33.91,-17 0 top  (outside the outline)
C11  5.08,-25.76 0 top  (outside the outline)
C12  19.69,-40.62 0 top  (outside the outline)
C13  28.5,6.9 0 top
C15  21.1,10.2 180 top
C16  10.29,-25.76 0 top  (outside the outline)
C21  24.5,3.6 270 top
C26  37.09,-35.92 0 top  (outside the outline)
C28  17.53,-31.35 0 top  (outside the outline)
CHARGE  22.61,-19.41 0 top  (outside the outline)
D2  9.53,-67.8 0 top  (outside the outline)
D3  11.18,-48.11 0 top  (outside the outline)
D4  5.46,-90.28 0 top  (outside the outline)
D5  5.46,-96.25 0 top  (outside the outline)
D6  8,-77.96 0 top  (outside the outline)
ESP32_ON  29.2,10.2 180 top
IC1  34.93,-25.38 0 top  (outside the outline)
IC3  28.5,22.5 90 top
IC5  24.77,-47.98 0 top  (outside the outline)
IC6  10.67,-51.16 0 top  (outside the outline)
IC8  35.56,-40.62 0 top  (outside the outline)
IC9  3.3,14.5 0 top
J9  47.5,2.9 0 top
J16  6.9,31.45 270 top
L1  6.1,-18.27 0 top  (outside the outline)
LED1  7.57,10.64 90 top
PTC  6.99,-83.55 0 top  (outside the outline)
Q1  23.37,-44.56 0 top  (outside the outline)
Q2  10.54,-101.07 0 top  (outside the outline)
R4  24,-31.35 0 top  (outside the outline)
R9  32.2,9.5 0 top
R10  26.9,10.2 270 top
R11  4.57,-73.77 0 top  (outside the outline)
R12  9.27,-73.77 0 top  (outside the outline)
R13  17.53,-67.42 0 top  (outside the outline)
R15  19.81,-36.3 0 top  (outside the outline)
R16  9.91,-36.3 0 top  (outside the outline)
R19  25.4,6.9 180 top
R22  16.13,-95.74 0 top  (outside the outline)
R27  24.13,-36.3 0 top  (outside the outline)
R28  29.59,-31.35 0 top  (outside the outline)
R29  14.86,-36.3 0 top  (outside the outline)
R30  7.49,16.53 0 top
R31  7.49,14.37 0 top
RESET  28.5,3.6 180 top
S1  5,24.75 270 top
U$1  90,5 0 top
U$2  5,5 0 top
U$3  5,40 0 top
U$4  90,40 0 top

### Tracks (layer width: path | path; a pad name or v marks a point on that pad's centre or on a via)
5V_ENABLE  (1 unrouted)
!RESET  (6 unrouted)
+3V3  (12 unrouted)
  pour Route2: 5.59,46.63 88.14,46.63 88.14,-1.63 5.59,-1.63
+5V  (3 unrouted)
BAT_ALERT  (1 unrouted)
BOOT0  (2 unrouted)
D+  (3 unrouted)
D-  (3 unrouted)
ESP_ON  (1 unrouted)
EXT_GND  (6 unrouted)
GATE_PROT  (2 unrouted)
GND  (50 unrouted)
  pour Route15: 3.05,47.9 90.68,47.9 90.68,-2.77 3.05,-2.77
  pour Top: 14.98,14.5 23.6,14.5 23.5,12.4 21.8,12.4 21.8,11 arc-90 19.1,8.3 17.7,8.3 arc-90 15,11 15,11.38 arc90 14.98,11.4
LDO_EN  (2 unrouted)
N$6  (1 unrouted)
N$9  (1 unrouted)
N$10  (1 unrouted)
N$11  (1 unrouted)
N$12  (1 unrouted)
N$13  (1 unrouted)
N$14  (1 unrouted)
N$15  (1 unrouted)
N$16  (1 unrouted)
N$17  (1 unrouted)
N$18  (1 unrouted)
N$21  (1 unrouted)
N$33  (1 unrouted)
PWR_BUTTON  (1 unrouted)
SCL1  (1 unrouted)
SDA1  (1 unrouted)
USB_VBUS  (2 unrouted)
USBBUS  (2 unrouted)
V_BAT  (6 unrouted)
VBUS  (8 unrouted)
VIN  (7 unrouted)

### Text on the board
tNames: ESP32 | On/Off